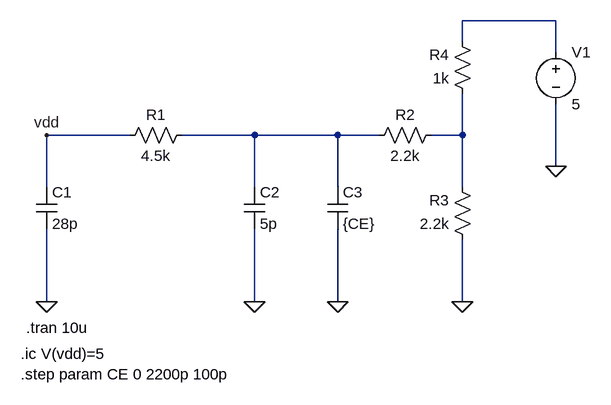
[diagram p0: schematic Discharge.asc]
Discharge.asc, the LTspice schematic file:
Version 4
SHEET 1 904 680
WIRE 848 -112 704 -112
WIRE 704 -80 704 -112
WIRE 848 -64 848 -112
WIRE 192 64 64 64
WIRE 384 64 272 64
WIRE 512 64 384 64
WIRE 576 64 512 64
WIRE 704 64 704 0
WIRE 704 64 656 64
WIRE 848 112 848 16
WIRE 64 144 64 64
WIRE 384 144 384 64
WIRE 512 144 512 64
WIRE 704 144 704 64
WIRE 64 320 64 208
WIRE 384 320 384 208
WIRE 512 320 512 208
WIRE 704 320 704 224
FLAG 64 320 0
FLAG 384 320 0
FLAG 64 64 vdd
FLAG 848 112 0
FLAG 512 320 0
FLAG 704 320 0
SYMBOL cap 48 144 R0
SYMATTR InstName C1
SYMATTR Value 28p
SYMBOL cap 368 144 R0
SYMATTR InstName C2
SYMATTR Value 5p
SYMBOL res 288 48 R90
WINDOW 0 0 56 VBottom 2
WINDOW 3 32 56 VTop 2
SYMATTR InstName R1
SYMATTR Value 4.5k
SYMBOL voltage 848 -80 R0
WINDOW 123 0 0 Left 0
WINDOW 39 0 0 Left 0
SYMATTR InstName V1
SYMATTR Value 5
SYMBOL res 672 48 R90
WINDOW 0 0 56 VBottom 2
WINDOW 3 32 56 VTop 2
SYMATTR InstName R2
SYMATTR Value 2.2k
SYMBOL cap 496 144 R0
SYMATTR InstName C3
SYMATTR Value {CE}
SYMBOL res 720 240 R180
WINDOW 0 36 76 Left 2
WINDOW 3 36 40 Left 2
SYMATTR InstName R3
SYMATTR Value 2.2k
SYMBOL res 720 16 R180
WINDOW 0 36 76 Left 2
WINDOW 3 36 40 Left 2
SYMATTR InstName R4
SYMATTR Value 1k
TEXT 24 400 Left 2 !.ic V(vdd)=5
TEXT 32 360 Left 2 !.tran 10u
TEXT 24 432 Left 2 !.step param CE 0 2200p 100p

The netlist it stands for:
* Discharge.asc
C1 vdd 0 28p
C2 N002 0 5p
R1 N002 vdd 4.5k
V1 N001 0 5
R2 N003 N002 2.2k
C3 N002 0 {CE}
R3 0 N003 2.2k
R4 N003 N001 1k
.ic V(vdd)=5
.tran 10u
.step param CE 0 2200p 100p
.backanno
.end